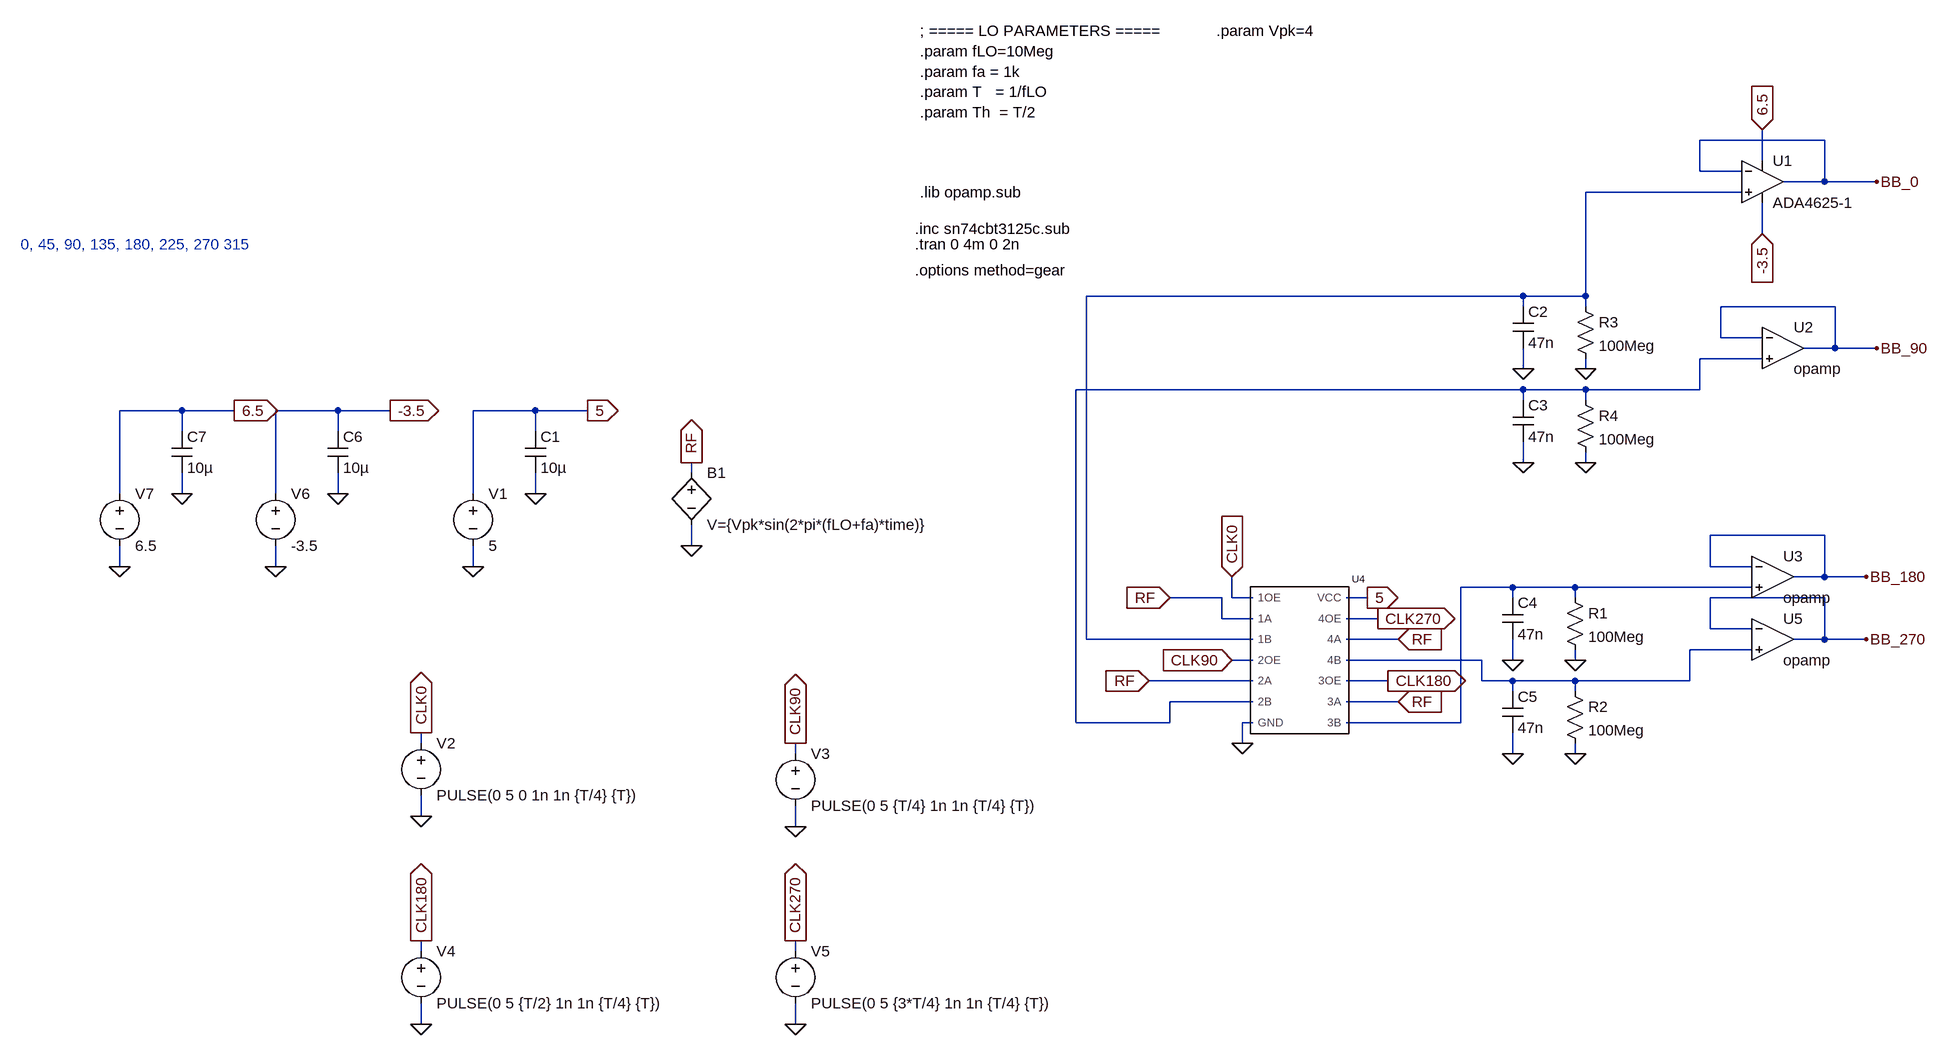
[diagram p0: schematic sn74cbt3125c_4_channel.asc]
sn74cbt3125c_4_channel.asc, the LTspice schematic file:
Version 4.1
SHEET 1 2160 2448
WIRE 1968 -656 1776 -656
WIRE 1872 -624 1872 -672
WIRE 1776 -608 1776 -656
WIRE 1840 -608 1776 -608
WIRE 1968 -592 1968 -656
WIRE 1968 -592 1904 -592
WIRE 2048 -592 1968 -592
WIRE 1840 -576 1600 -576
WIRE 1872 -512 1872 -560
WIRE 1504 -416 832 -416
WIRE 1600 -416 1600 -576
WIRE 1600 -416 1504 -416
WIRE 1504 -400 1504 -416
WIRE 1600 -400 1600 -416
WIRE 1984 -400 1808 -400
WIRE 1808 -352 1808 -400
WIRE 1872 -352 1808 -352
WIRE 1984 -336 1984 -400
WIRE 1984 -336 1936 -336
WIRE 2048 -336 1984 -336
WIRE 1872 -320 1776 -320
WIRE 1504 -304 1504 -336
WIRE 1600 -304 1600 -320
WIRE 1504 -272 816 -272
WIRE 1600 -272 1504 -272
WIRE 1776 -272 1776 -320
WIRE 1776 -272 1600 -272
WIRE 1504 -256 1504 -272
WIRE 1600 -256 1600 -272
WIRE -560 -240 -656 -240
WIRE -480 -240 -560 -240
WIRE -320 -240 -416 -240
WIRE -240 -240 -320 -240
WIRE -16 -240 -112 -240
WIRE 64 -240 -16 -240
WIRE -560 -208 -560 -240
WIRE -320 -208 -320 -240
WIRE -16 -208 -16 -240
WIRE 1504 -160 1504 -192
WIRE 1600 -160 1600 -176
WIRE 224 -144 224 -160
WIRE -656 -112 -656 -240
WIRE -560 -112 -560 -144
WIRE -416 -112 -416 -240
WIRE -320 -112 -320 -144
WIRE -112 -112 -112 -240
WIRE -16 -112 -16 -144
WIRE 1968 -48 1792 -48
WIRE 224 -32 224 -64
WIRE -656 0 -656 -32
WIRE -416 0 -416 -32
WIRE -112 0 -112 -32
WIRE 1792 0 1792 -48
WIRE 1856 0 1792 0
WIRE 1968 16 1968 -48
WIRE 1968 16 1920 16
WIRE 2032 16 1968 16
WIRE 1488 32 1408 32
WIRE 1584 32 1488 32
WIRE 1856 32 1584 32
WIRE 1040 48 960 48
WIRE 1056 48 1056 16
WIRE 1088 48 1056 48
WIRE 1264 48 1232 48
WIRE 1488 48 1488 32
WIRE 1584 48 1584 32
WIRE 1968 48 1792 48
WIRE 1040 80 1040 48
WIRE 1088 80 1040 80
WIRE 1280 80 1232 80
WIRE 1792 96 1792 48
WIRE 1856 96 1792 96
WIRE 832 112 832 -416
WIRE 1088 112 832 112
WIRE 1312 112 1232 112
WIRE 1968 112 1968 48
WIRE 1968 112 1920 112
WIRE 2032 112 1968 112
WIRE 1856 128 1760 128
WIRE 1088 144 1056 144
WIRE 1440 144 1232 144
WIRE 1488 144 1488 112
WIRE 1584 144 1584 128
WIRE 1088 176 928 176
WIRE 1296 176 1232 176
WIRE 1440 176 1440 144
WIRE 1488 176 1440 176
WIRE 1584 176 1488 176
WIRE 1760 176 1760 128
WIRE 1760 176 1584 176
WIRE 1488 192 1488 176
WIRE 1584 192 1584 176
WIRE 1088 208 960 208
WIRE 1312 208 1232 208
WIRE 816 240 816 -272
WIRE 960 240 960 208
WIRE 960 240 816 240
WIRE 1088 240 1072 240
WIRE 1408 240 1408 32
WIRE 1408 240 1232 240
WIRE -192 272 -192 256
WIRE 1072 272 1072 240
WIRE 384 288 384 272
WIRE 1488 288 1488 256
WIRE 1584 288 1584 272
WIRE -192 384 -192 352
WIRE 384 400 384 368
WIRE -192 592 -192 576
WIRE 384 592 384 576
WIRE -192 704 -192 672
WIRE 384 704 384 672
FLAG -112 0 0
FLAG 384 400 0
FLAG 224 -32 0
FLAG 64 -240 5
IOPIN 64 -240 Out
FLAG 224 -160 RF
IOPIN 224 -160 Out
FLAG 960 48 RF
IOPIN 960 48 In
FLAG -192 576 CLK180
IOPIN -192 576 Out
FLAG 1056 16 CLK0
IOPIN 1056 16 In
FLAG 1072 272 0
FLAG 1056 144 CLK90
IOPIN 1056 144 In
FLAG -16 -112 0
FLAG 928 176 RF
IOPIN 928 176 In
FLAG -192 704 0
FLAG 384 272 CLK90
IOPIN 384 272 Out
FLAG 1504 -304 0
FLAG 1600 -304 0
FLAG 1504 -160 0
FLAG 1600 -160 0
FLAG 2048 -592 BB_0
FLAG 2048 -336 BB_90
FLAG 1488 144 0
FLAG 1584 144 0
FLAG 1488 288 0
FLAG 1584 288 0
FLAG 2032 16 BB_180
FLAG 2032 112 BB_270
FLAG -192 256 CLK0
IOPIN -192 256 Out
FLAG -192 384 0
FLAG 384 576 CLK270
IOPIN 384 576 Out
FLAG 384 704 0
FLAG 1296 176 CLK180
IOPIN 1296 176 Out
FLAG 1264 48 5
IOPIN 1264 48 Out
FLAG 1280 80 CLK270
IOPIN 1280 80 Out
FLAG 1312 208 RF
IOPIN 1312 208 In
FLAG 1312 112 RF
IOPIN 1312 112 In
FLAG -416 0 0
FLAG -240 -240 -3.5
IOPIN -240 -240 Out
FLAG -320 -112 0
FLAG -656 0 0
FLAG -480 -240 6.5
IOPIN -480 -240 Out
FLAG -560 -112 0
FLAG 1872 -672 6.5
IOPIN 1872 -672 In
FLAG 1872 -512 -3.5
IOPIN 1872 -512 In
SYMBOL sn74cbt3125casy 1184 112 R0
SYMATTR InstName U4
SYMBOL voltage -112 -128 R0
WINDOW 123 0 0 Left 0
WINDOW 39 0 0 Left 0
SYMATTR InstName V1
SYMATTR Value 5
SYMBOL voltage 384 272 R0
WINDOW 123 0 0 Left 0
WINDOW 39 0 0 Left 0
SYMATTR InstName V3
SYMATTR Value PULSE(0 5 {T/4} 1n 1n {T/4} {T})
SYMBOL cap -32 -208 R0
SYMATTR InstName C1
SYMATTR Value 10µ
SYMBOL voltage -192 576 R0
WINDOW 123 0 0 Left 0
WINDOW 39 0 0 Left 0
SYMATTR InstName V4
SYMATTR Value PULSE(0 5 {T/2} 1n 1n {T/4} {T})
SYMBOL OpAmps\\opamp 1904 -400 R0
SYMATTR InstName U2
SYMBOL cap 1488 -400 R0
SYMATTR InstName C2
SYMATTR Value 47n
SYMBOL res 1584 -416 R0
SYMATTR InstName R3
SYMATTR Value 100Meg
SYMBOL cap 1488 -256 R0
SYMATTR InstName C3
SYMATTR Value 47n
SYMBOL res 1584 -272 R0
SYMATTR InstName R4
SYMATTR Value 100Meg
SYMBOL bv 224 -160 R0
SYMATTR InstName B1
SYMATTR Value V={Vpk*sin(2*pi*(fLO+fa)*time)}
SYMBOL OpAmps\\opamp 1888 -48 R0
SYMATTR InstName U3
SYMBOL OpAmps\\opamp 1888 48 R0
SYMATTR InstName U5
SYMBOL cap 1472 48 R0
SYMATTR InstName C4
SYMATTR Value 47n
SYMBOL res 1568 32 R0
SYMATTR InstName R1
SYMATTR Value 100Meg
SYMBOL cap 1472 192 R0
SYMATTR InstName C5
SYMATTR Value 47n
SYMBOL res 1568 176 R0
SYMATTR InstName R2
SYMATTR Value 100Meg
SYMBOL voltage -192 256 R0
WINDOW 123 0 0 Left 0
WINDOW 39 0 0 Left 0
SYMATTR InstName V2
SYMATTR Value PULSE(0 5 0 1n 1n {T/4} {T})
SYMBOL voltage 384 576 R0
WINDOW 123 0 0 Left 0
WINDOW 39 0 0 Left 0
SYMATTR InstName V5
SYMATTR Value PULSE(0 5 {3*T/4} 1n 1n {T/4} {T})
SYMBOL OpAmps\\ADA4625-1 1872 -656 R0
SYMATTR InstName U1
SYMBOL voltage -416 -128 R0
WINDOW 123 0 0 Left 0
WINDOW 39 0 0 Left 0
SYMATTR InstName V6
SYMATTR Value -3.5
SYMBOL cap -336 -208 R0
SYMATTR InstName C6
SYMATTR Value 10µ
SYMBOL voltage -656 -128 R0
WINDOW 123 0 0 Left 0
WINDOW 39 0 0 Left 0
SYMATTR InstName V7
SYMATTR Value 6.5
SYMBOL cap -576 -208 R0
SYMATTR InstName C7
SYMATTR Value 10µ
TEXT 568 -496 Left 2 !.tran 0 4m 0 2n
TEXT 568 -456 Left 2 !.options method=gear
TEXT 568 -520 Left 2 !.inc sn74cbt3125c.sub
TEXT 576 -576 Left 2 !.lib opamp.sub
TEXT 576 -824 Left 2 !; ===== LO PARAMETERS =====\n.param fLO=10Meg\n.param fa = 1k\n.param T   = 1/fLO\n.param Th  = T/2
TEXT 1032 -824 Left 2 !.param Vpk=4
TEXT -808 -496 Left 2 ;0, 45, 90, 135, 180, 225, 270 315

The netlist it stands for:
* sn74cbt3125c_4_channel.asc
X§U4 CLK0 RF N001 CLK90 RF N002 0 N003 RF CLK180 N004 RF CLK270 5 SN74CBT3125C  ; pins 1OE 1A 1B 2OE 2A 2B GND 3B 3A 3OE 4B 4A 4OE VCC
V1 5 0 5
V3 CLK90 0 PULSE(0 5 {T/4} 1n 1n {T/4} {T})
C1 5 0 10µ
V4 CLK180 0 PULSE(0 5 {T/2} 1n 1n {T/4} {T})
X§U2 BB_90 N002 BB_90 opamp Aol=100K GBW=10Meg  ; pins invin noninvin out
C2 N001 0 47n
R3 N001 0 100Meg
C3 N002 0 47n
R4 N002 0 100Meg
B1 RF 0 V={Vpk*sin(2*pi*(fLO+fa)*time)}
X§U3 BB_180 N003 BB_180 opamp Aol=100K GBW=10Meg  ; pins invin noninvin out
X§U5 BB_270 N004 BB_270 opamp Aol=100K GBW=10Meg  ; pins invin noninvin out
C4 N003 0 47n
R1 N003 0 100Meg
C5 N004 0 47n
R2 N004 0 100Meg
V2 CLK0 0 PULSE(0 5 0 1n 1n {T/4} {T})
V5 CLK270 0 PULSE(0 5 {3*T/4} 1n 1n {T/4} {T})
X§U1 N001 BB_0 6.5 -3.5 BB_0 ADA4625-1  ; pins In+ In- V+ V- OUT
V6 -3.5 0 -3.5
C6 -3.5 0 10µ
V7 6.5 0 6.5
C7 6.5 0 10µ
.tran 0 4m 0 2n
.options method=gear
.inc sn74cbt3125c.sub
.lib opamp.sub
; ===== LO PARAMETERS =====
.param fLO=10Meg
.param fa = 1k
.param T   = 1/fLO
.param Th  = T/2
.param Vpk=4
* 0, 45, 90, 135, 180, 225, 270 315
.backanno
.end